# Altium schematic sheet COREv1.4.SchDoc
size A2
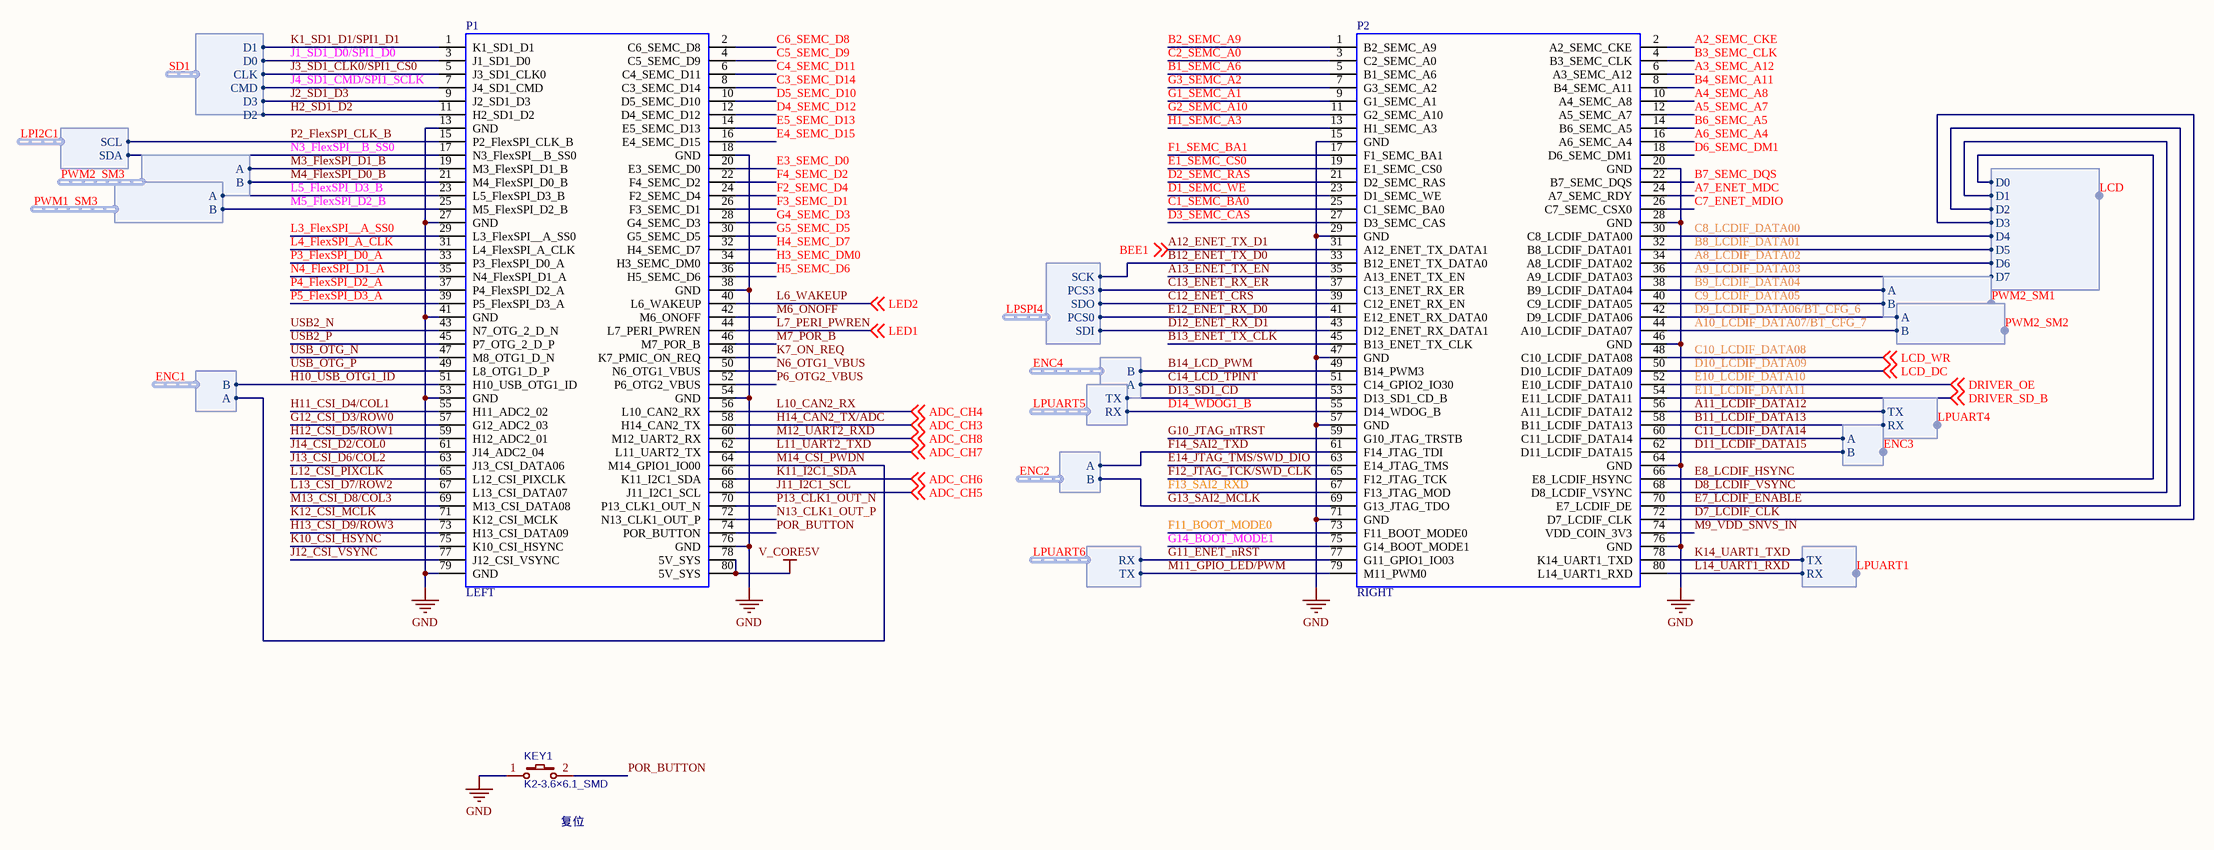
[diagram p0: COREv1.4.SchDoc]

## Parts
KEY1  K2-3.6×6.1_SMD  [KEY-SMD_2P-L6.2-W3.6-LS8.0]
P1  LEFT  [CON80]
P2  RIGHT  [CON80]

## Harnesses
I2C: SDA, SCL
data: D0, D1, D2, D3, D4, D5, D6, D7
PWM_SM: A, B
ENC: A, B
uart: TX, RX
SDHC: D1, D0, CLK, CMD, D3, D2
SPI: SDI, SDO, SCK, PCS0, PCS3

## Nets
GND: KEY1.1 P1.13(GND) P1.18(GND) P1.27(GND) P1.38(GND) P1.41(GND) P1.53(GND) P1.54(GND) P1.76(GND) P1.79(GND) P2.15(GND) P2.20(GND) P2.28(GND) P2.29(GND) P2.46(GND) P2.47(GND) P2.57(GND) P2.64(GND) P2.71(GND) P2.76(GND)
V_CORE5V: P1.78(5V_SYS) P1.80(5V_SYS)
A2_SEMC_CKE: P2.2(A2_SEMC_CKE)
A3_SEMC_A12: P2.6(A3_SEMC_A12)
A4_SEMC_A8: P2.10(A4_SEMC_A8)
A5_SEMC_A7: P2.12(A5_SEMC_A7)
A6_SEMC_A4: P2.16(A6_SEMC_A4)
A7_ENET_MDC: P2.24(A7_SEMC_RDY)
A8_LCDIF_DATA02: P2.34(A8_LCDIF_DATA02) ; harness data.D6
A9_LCDIF_DATA03: P2.36(A9_LCDIF_DATA03) ; harness data.D7
A10_LCDIF_DATA07/BT_CFG_7: P2.44(A10_LCDIF_DATA07) ; harness PWM_SM.B
A11_LCDIF_DATA12: P2.56(A11_LCDIF_DATA12) ; harness uart.TX
A12_ENET_TX_D1: P2.31(A12_ENET_TX_DATA1) ; off-sheet BEE1  [also labelled BEE1]
A13_ENET_TX_EN: P2.35(A13_ENET_TX_EN)
B1_SEMC_A6: P2.5(B1_SEMC_A6)
B2_SEMC_A9: P2.1(B2_SEMC_A9)
B3_SEMC_CLK: P2.4(B3_SEMC_CLK)
B4_SEMC_A11: P2.8(B4_SEMC_A11)
B6_SEMC_A5: P2.14(B6_SEMC_A5)
B7_SEMC_DQS: P2.22(B7_SEMC_DQS)
B8_LCDIF_DATA01: P2.32(B8_LCDIF_DATA01) ; harness data.D5
B9_LCDIF_DATA04: P2.38(B9_LCDIF_DATA04) ; harness PWM_SM.A
B11_LCDIF_DATA13: P2.58(B11_LCDIF_DATA13) ; harness uart.RX
B12_ENET_TX_D0: P2.33(B12_ENET_TX_DATA0) ; harness SPI.SCK
B13_ENET_TX_CLK: P2.45(B13_ENET_TX_CLK)
B14_LCD_PWM: P2.49(B14_PWM3) ; harness ENC.B
C1_SEMC_BA0: P2.25(C1_SEMC_BA0)
C2_SEMC_A0: P2.3(C2_SEMC_A0)
C3_SEMC_D14: P1.8(C3_SEMC_D14)
C4_SEMC_D11: P1.6(C4_SEMC_D11)
C5_SEMC_D9: P1.4(C5_SEMC_D9)
C6_SEMC_D8: P1.2(C6_SEMC_D8)
C7_ENET_MDIO: P2.26(C7_SEMC_CSX0)
C8_LCDIF_DATA00: P2.30(C8_LCDIF_DATA00) ; harness data.D4
C9_LCDIF_DATA05: P2.40(C9_LCDIF_DATA05) ; harness PWM_SM.B
C10_LCDIF_DATA08: P2.48(C10_LCDIF_DATA08) ; off-sheet LCD_WR  [also labelled LCD_WR]
C11_LCDIF_DATA14: P2.60(C11_LCDIF_DATA14) ; harness ENC.A
C12_ENET_CRS: P2.39(C12_ENET_RX_EN) ; harness SPI.SDO
C13_ENET_RX_ER: P2.37(C13_ENET_RX_ER) ; harness SPI.PCS3
C14_LCD_TPINT: P2.51(C14_GPIO2_IO30) ; harness ENC.A
D1_SEMC_WE: P2.23(D1_SEMC_WE)
D2_SEMC_RAS: P2.21(D2_SEMC_RAS)
D3_SEMC_CAS: P2.27(D3_SEMC_CAS)
D4_SEMC_D12: P1.12(D4_SEMC_D12)
D5_SEMC_D10: P1.10(D5_SEMC_D10)
D6_SEMC_DM1: P2.18(D6_SEMC_DM1)
D7_LCDIF_CLK: P2.72(D7_LCDIF_CLK) ; harness data.D3
D8_LCDIF_VSYNC: P2.68(D8_LCDIF_VSYNC) ; harness data.D1
D9_LCDIF_DATA06/BT_CFG_6: P2.42(D9_LCDIF_DATA06) ; harness PWM_SM.A
D10_LCDIF_DATA09: P2.50(D10_LCDIF_DATA09) ; off-sheet LCD_DC  [also labelled LCD_DC]
D11_LCDIF_DATA15: P2.62(D11_LCDIF_DATA15) ; harness ENC.B
D12_ENET_RX_D1: P2.43(D12_ENET_RX_DATA1) ; harness SPI.SDI
D13_SD1_CD: P2.53(D13_SD1_CD_B) ; harness uart.TX
D14_WDOG1_B: P2.55(D14_WDOG_B) ; harness uart.RX
E1_SEMC_CS0: P2.19(E1_SEMC_CS0)
E3_SEMC_D0: P1.20(E3_SEMC_D0)
E4_SEMC_D15: P1.16(E4_SEMC_D15)
E5_SEMC_D13: P1.14(E5_SEMC_D13)
E7_LCDIF_ENABLE: P2.70(E7_LCDIF_DE) ; harness data.D2
E8_LCDIF_HSYNC: P2.66(E8_LCDIF_HSYNC) ; harness data.D0
E10_LCDIF_DATA10: P2.52(E10_LCDIF_DATA10) ; off-sheet DRIVER_OE  [also labelled DRIVER_OE]
E11_LCDIF_DATA11: P2.54(E11_LCDIF_DATA11) ; off-sheet DRIVER_SD_B  [also labelled DRIVER_SD_B]
E12_ENET_RX_D0: P2.41(E12_ENET_RX_DATA0) ; harness SPI.PCS0
E14_JTAG_TMS/SWD_DIO: P2.63(E14_JTAG_TMS)
F1_SEMC_BA1: P2.17(F1_SEMC_BA1)
F2_SEMC_D4: P1.24(F2_SEMC_D4)
F3_SEMC_D1: P1.26(F3_SEMC_D1)
F4_SEMC_D2: P1.22(F4_SEMC_D2)
F11_BOOT_MODE0: P2.73(F11_BOOT_MODE0)
F12_JTAG_TCK/SWD_CLK: P2.65(F12_JTAG_TCK)
F13_SAI2_RXD: P2.67(F13_JTAG_MOD)
F14_SAI2_TXD: P2.61(F14_JTAG_TDI) ; harness ENC.A  [project net ENC2.A]
G1_SEMC_A1: P2.9(G1_SEMC_A1)
G2_SEMC_A10: P2.11(G2_SEMC_A10)
G3_SEMC_A2: P2.7(G3_SEMC_A2)
G4_SEMC_D3: P1.28(G4_SEMC_D3)
G5_SEMC_D5: P1.30(G5_SEMC_D5)
G10_JTAG_nTRST: P2.59(G10_JTAG_TRSTB)
G11_ENET_nRST: P2.77(G11_GPIO1_IO03) ; harness uart.RX
G12_CSI_D3/ROW0: P1.57(G12_ADC2_03)
G13_SAI2_MCLK: P2.69(G13_JTAG_TDO) ; harness ENC.B  [project net ENC2.B]
G14_BOOT_MODE1: P2.75(G14_BOOT_MODE1)
H1_SEMC_A3: P2.13(H1_SEMC_A3)
H2_SD1_D2: P1.11(H2_SD1_D2) ; harness SDHC.D2
H3_SEMC_DM0: P1.34(H3_SEMC_DM0)
H4_SEMC_D7: P1.32(H4_SEMC_D7)
H5_SEMC_D6: P1.36(H5_SEMC_D6)
H10_USB_OTG1_ID: P1.51(H10_USB_OTG1_ID) ; harness ENC.B  [project net ENC1.B]
H11_CSI_D4/COL1: P1.55(H11_ADC2_02)
H12_CSI_D5/ROW1: P1.59(H12_ADC2_01)
H13_CSI_D9/ROW3: P1.73(H13_CSI_DATA09)
H14_CAN2_TX/ADC: P1.58(H14_CAN2_TX) ; off-sheet ADC_CH3  [also labelled ADC_CH3]
J1_SD1_D0/SPI1_D0: P1.3(J1_SD1_D0) ; harness SDHC.D0
J2_SD1_D3: P1.9(J2_SD1_D3) ; harness SDHC.D3
J3_SD1_CLK0/SPI1_CS0: P1.5(J3_SD1_CLK0) ; harness SDHC.CLK
J4_SD1_CMD/SPI1_SCLK: P1.7(J4_SD1_CMD) ; harness SDHC.CMD
J11_I2C1_SCL: P1.68(J11_I2C1_SCL) ; off-sheet ADC_CH5  [also labelled ADC_CH5]
J12_CSI_VSYNC: P1.77(J12_CSI_VSYNC)
J13_CSI_D6/COL2: P1.63(J13_CSI_DATA06)
J14_CSI_D2/COL0: P1.61(J14_ADC2_04)
K1_SD1_D1/SPI1_D1: P1.1(K1_SD1_D1) ; harness SDHC.D1
K7_ON_REQ: P1.48(K7_PMIC_ON_REQ)
K10_CSI_HSYNC: P1.75(K10_CSI_HSYNC)
K11_I2C1_SDA: P1.66(K11_I2C1_SDA) ; off-sheet ADC_CH6  [also labelled ADC_CH6]
K12_CSI_MCLK: P1.71(K12_CSI_MCLK)
K14_UART1_TXD: P2.78(K14_UART1_TXD) ; harness uart.TX
L3_FlexSPI__A_SS0: P1.29(L3_FlexSPI__A_SS0)
L4_FlexSPI_A_CLK: P1.31(L4_FlexSPI_A_CLK)
L5_FlexSPI_D3_B: P1.23(L5_FlexSPI_D3_B) ; harness PWM_SM.A
L6_WAKEUP: P1.40(L6_WAKEUP) ; off-sheet LED2  [also labelled LED2]
L7_PERI_PWREN: P1.44(L7_PERI_PWREN) ; off-sheet LED1  [also labelled LED1]
L10_CAN2_RX: P1.56(L10_CAN2_RX) ; off-sheet ADC_CH4  [also labelled ADC_CH4]
L11_UART2_TXD: P1.62(L11_UART2_TX) ; off-sheet ADC_CH7  [also labelled ADC_CH7]
L12_CSI_PIXCLK: P1.65(L12_CSI_PIXCLK)
L13_CSI_D7/ROW2: P1.67(L13_CSI_DATA07)
L14_UART1_RXD: P2.80(L14_UART1_RXD) ; harness uart.RX
M3_FlexSPI_D1_B: P1.19(M3_FlexSPI_D1_B) ; harness PWM_SM.A
M4_FlexSPI_D0_B: P1.21(M4_FlexSPI_D0_B) ; harness PWM_SM.B
M5_FlexSPI_D2_B: P1.25(M5_FlexSPI_D2_B) ; harness PWM_SM.B
M6_ONOFF: P1.42(M6_ONOFF)
M7_POR_B: P1.46(M7_POR_B)
M9_VDD_SNVS_IN: P2.74(VDD_COIN_3V3)
M11_GPIO_LED/PWM: P2.79(M11_PWM0) ; harness uart.TX  [project net LPUART6.TX]
M12_UART2_RXD: P1.60(M12_UART2_RX) ; off-sheet ADC_CH8  [also labelled ADC_CH8]
M13_CSI_D8/COL3: P1.69(M13_CSI_DATA08)
M14_CSI_PWDN: P1.64(M14_GPIO1_IO00) ; harness ENC.A  [project net ENC1.A]
N3_FlexSPI__B_SS0: P1.17(N3_FlexSPI__B_SS0) ; harness I2C.SDA  [project net LPI2C1.SDA]
N4_FlexSPI_D1_A: P1.35(N4_FlexSPI_D1_A)
N6_OTG1_VBUS: P1.50(N6_OTG1_VBUS)
N13_CLK1_OUT_P: P1.72(N13_CLK1_OUT_P)
P2_FlexSPI_CLK_B: P1.15(P2_FlexSPI_CLK_B) ; harness I2C.SCL  [project net LPI2C1.SCL]
P3_FlexSPI_D0_A: P1.33(P3_FlexSPI_D0_A)
P4_FlexSPI_D2_A: P1.37(P4_FlexSPI_D2_A)
P5_FlexSPI_D3_A: P1.39(P5_FlexSPI_D3_A)
P6_OTG2_VBUS: P1.52(P6_OTG2_VBUS)
P13_CLK1_OUT_N: P1.70(P13_CLK1_OUT_N)
POR_BUTTON: KEY1.2 P1.74(POR_BUTTON)
USB2_N: P1.43(N7_OTG_2_D_N)
USB2_P: P1.45(P7_OTG_2_D_P)
USB_OTG_N: P1.47(M8_OTG1_D_N)
USB_OTG_P: P1.49(L8_OTG1_D_P)

## Notes on the sheet
- (near KEY1) 复位

## Library data of the parts
KEY1 = K2-3.6×6.1_SMD: BOM_Manufacturer Part: K2-1107ST-A4SW-06; Contributor: LCEDA_Lib; 制造商: 韩国韩荣; BOM_Supplier Part: C118141; BOM_Supplier: LCSC; spicePre: K; spiceSymbolName: K2-3.6×6.1_SMD
P1 = Header40X2_left: Header, 30-Pin, Dual row; LatestRevisionDate: 17-Jul-2002; LatestRevisionNote: Re-released for DXP Platform.; Publisher: Altium Limited
P2 = Header40X2_right: Header, 30-Pin, Dual row; LatestRevisionDate: 17-Jul-2002; LatestRevisionNote: Re-released for DXP Platform.; Publisher: Altium Limited